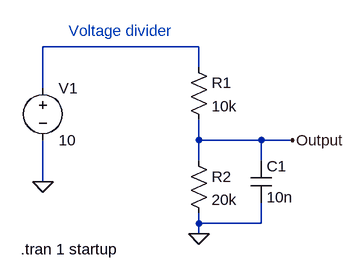
[diagram p0: schematic Draft2.asc]
Draft2.asc, the LTspice schematic file:
Version 4
SHEET 1 880 680
WIRE 304 48 64 48
WIRE 304 80 304 48
WIRE 64 112 64 48
WIRE 304 192 304 160
WIRE 400 192 304 192
WIRE 448 192 400 192
WIRE 304 224 304 192
WIRE 400 224 400 192
WIRE 64 256 64 192
WIRE 304 320 304 304
WIRE 400 320 400 288
WIRE 400 320 304 320
WIRE 304 336 304 320
FLAG 64 256 0
FLAG 304 336 0
FLAG 448 192 Output
SYMBOL voltage 64 96 R0
WINDOW 123 0 0 Left 0
WINDOW 39 0 0 Left 0
SYMATTR InstName V1
SYMATTR Value 10
SYMBOL res 288 64 R0
SYMATTR InstName R1
SYMATTR Value 10k
SYMBOL res 288 208 R0
SYMATTR InstName R2
SYMATTR Value 20k
SYMBOL cap 384 224 R0
SYMATTR InstName C1
SYMATTR Value 10n
TEXT 30 360 Left 2 !.tran 1 startup
TEXT 104 24 Left 2 ;Voltage divider

The netlist it stands for:
* Draft2.asc
V1 N001 0 10
R1 N001 Output 10k
R2 Output 0 20k
C1 Output 0 10n
.tran 1 startup
* Voltage divider
.backanno
.end